# EAGLE design ChaiNEO_FrontConn_2x3 (EAGLE 9.6.2)
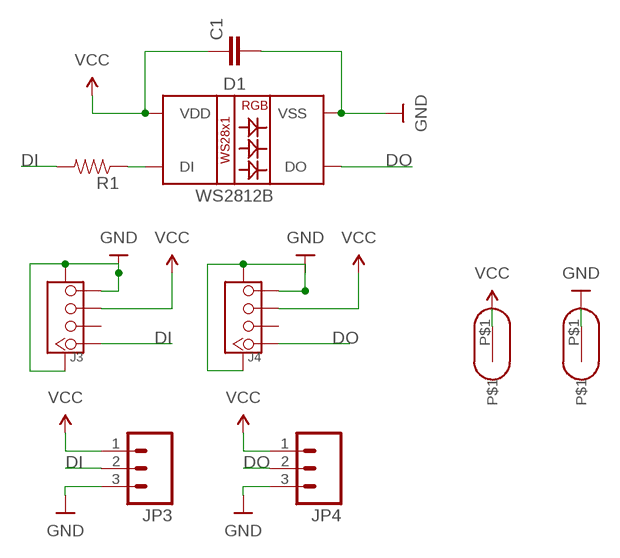
[diagram p0: schematic, sheet 1]

## Parts
C1  CAP0603-CAP  [0603-CAP]
D1  WS2812B  [WS2812B]
J3  TWIG-4P-2.0-SMD-FEMALE-REINFORCE90D  [4P-SMD-2.0-90D]
J4  TWIG-4P-2.0-SMD-FEMALE-REINFORCE90D  [4P-SMD-2.0-90D]
JP3  M03LONGPADS  [1X03_LONGPADS]
JP4  M03LONGPADS  [1X03_LONGPADS]
R1  RESISTOR0603-RES  [0603-RES]
U$7  PLATED_TIE_MOUNT  [PLATED_TIE_MOUNT]
U$8  PLATED_TIE_MOUNT  [PLATED_TIE_MOUNT]

## Nets
DI: J3.1 JP3.2 R1.2
DO: D1.2(DO) J4.1 JP4.2
GND: C1.2 D1.3(VSS) J3.4 J3.SS1 J3.SS2 J4.4 J4.SS1 J4.SS2 JP3.3 JP4.3 U$8.P$1
N$2: D1.4(DI) R1.1
VCC: C1.1 D1.1(VDD) J3.3 J4.3 JP3.1 JP4.1 U$7.P$1
Unconnected: J3.2 J4.2

## Library data of the parts
C1 = ChaiNEO:CAP: Capacitor Standard 0603 ceramic capacitor, and 0.1" leaded capacitor.
D1 = ChaiNEO:WS2812B: WS2812B SMD addressable RGB LED 5x5mm SMD LED with built-in controller IC. Color: Red/Green/Blue mC Rating: RGB: 390, 660, 180 mcd Forward Voltage: RGB: 2.0, 3.0, 3.0 V Packages:WS2812B SparkFun Products: Blynk Board - ESP8266 <https://www.sparkfun.com/products/13794>; PROD_ID: DIO-12503
J3 J4 = Grove_SMD:TWIG-4P-2.0-SMD-FEMALE-REINFORCE
JP3 JP4 = ChaiNEO:M03: Header 3 Standard 3-pin 0.1" header. Use with straight break away headers (SKU : PRT-00116), right angle break away headers (PRT-00553), swiss pins (PRT-00743), machine pins (PRT-00117), and female headers (PRT-00115). Molex polarized connector foot print use with SKU : PRT-08232 with associated crimp pins and housings.
R1 = ChaiNEO:RESISTOR: Resistor Basic schematic elements and footprints for 0603, 1206, and PTH resistors.
U$7 U$8 = ChaiNEO:PLATED_TIE_MOUNT

## Board
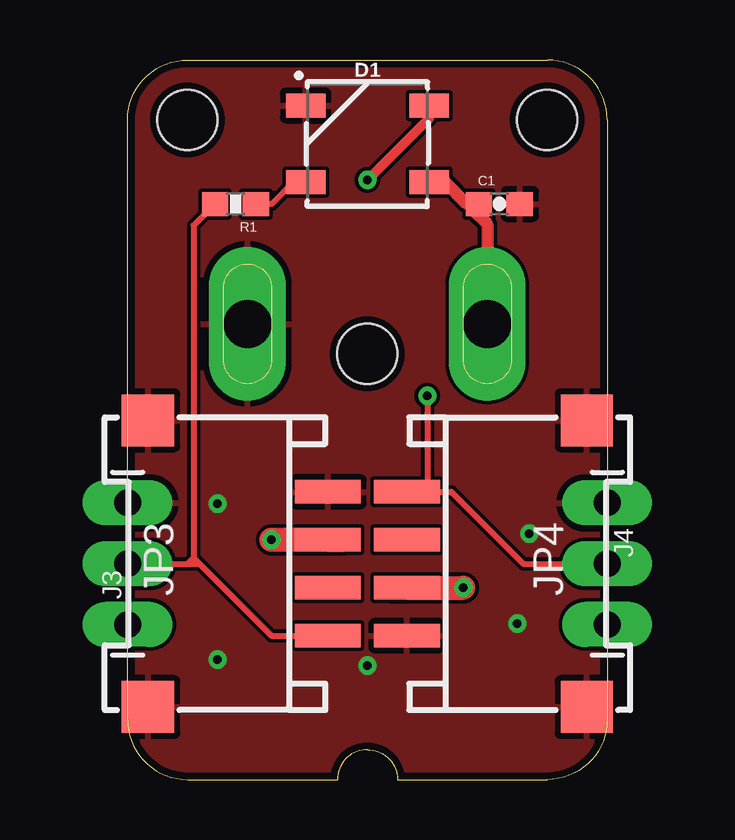
[diagram p1: board, top side]
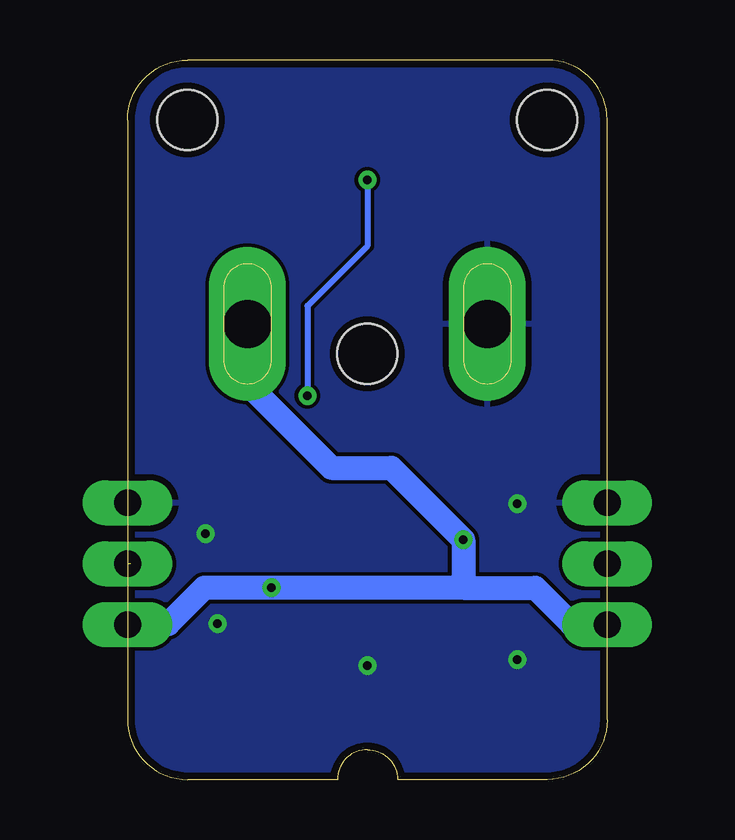
[diagram p2: board, bottom side, seen from below]

Size 20 x 30 mm. Coordinates in mm from the lower left corner, seen from the top.
Outline: 2.5,0 8.75,0 arc-90 10,1.25 arc-90 11.25,0 17.5,0 arc90 20,2.5 20,27.5 arc90 17.5,30 2.5,30 arc90 0,27.5 0,2.5 arc90 2.5,0
Copper layers (1*16): Top 0.035mm / dielectric 1.5mm / Bottom 0.035mm
Design rules "default *": minimum track width 6mil, minimum drill 0.35mm, track to track 6mil, track to pad 6mil, pad to pad 6mil, via to via 6mil, smd to smd 6mil, copper to edge 0.3mm, drill to drill 6mil, minimum pad ring 10mil, minimum via ring 8mil, stop-mask expansion 4mil, vias tented up to drill 20mil, thermal gap 10mil
Holes 2.5 mm at 10,17.75 2.5,27.5 17.5,27.5

### Footprints (pad centres in the part's own frame; a part is rotated, then mirrored left to right if it is on the bottom)
0603-CAP = smd 1.1 x 1: 1 -0.85,0; 2 0.85,0
WS2812B = smd 1.651 x 1: 1 2.577,-1.6; 2 2.577,1.6; 3 -2.577,1.6; 4 -2.577,-1.6
4P-SMD-2.0-90D = smd 0.965 x 2.74: 1 -3,-0.1; 2 -1,-0.1; 3 1,-0.1; 4 3,-0.1 | smd 2.159 x 2.184: SS1 -5.974,7.4; SS2 5.974,7.4
1X03_LONGPADS = drill 1.118 pad 1.88 long: 1 -2.54,0; 2 0,0; 3 2.54,0
0603-RES = smd 1.1 x 1: 1 -0.85,0; 2 0.85,0
PLATED_TIE_MOUNT = drill 2 pad 3.2 long: P$1 0,0

### Placement (x,y rotation side)
C1  15.5,24 0 top
D1  10,26.5 0 top
J3  8.25,9 90 top
J4  11.75,9 270 top
JP3  0,9 90 top
JP4  20,9 90 top
R1  4.5,24 180 top
U$7  15,19 0 top
U$8  5,19 0 top

### Tracks (layer width: path | path; a pad name or v marks a point on that pad's centre or on a via)
DI
  Top 0.254: J3.1 6,6 3,9 | JP3.2 2.5,9 | 2.5,9 2.75,9 | 2.75,9 3,9 | R1.2 2.75,23.1 2.75,9.25 | 2.75,9.25 2.75,9 | 2.75,9.25 2.5,9 | 2.75,9.25 3,9
DO  (via drill 0.35)  (1 unrouted)
  Top 0.254: v12.5,16 12.5,12.2 12.3,12 J4.1 13.5,12 16.5,9 19.87,9
  Top 0.406: v10,25 12.58,27.58 D1.2
  Bottom 0.254: v10,25 10,22.25 12.5,19.75 v12.5,16
GND  (via drill 0.35)
  other vias: 16.75,10.25 16.25,6.5 3.75,5 3.75,11.5 10,4.75
  pour Bottom: -0.5,-1 20.5,-1 20.5,31 -0.5,31
  pour Top: -1,-2 21,-2 21,32 -1,32
N$2
  Top 0.254: D1.4 6.92,24.9 6.02,24 R1.1
VCC  (via drill 0.35)
  Top 0.508: D1.1 13.25,24.9 14.15,24 C1.1 14.4,23.75 15,23.15 U$7.P$1
  Top 1: 9,10 J3.3 v6,10 | 11,8 J4.3 v14,8
  Bottom 1: 6,8 v14,8 16.8,8 18.3,6.5 | 6,8 3,8 1.5,6.5 | 6,8 v6,10 9,13 11.5,13 15,16.5
  Bottom 1.016: JP4.1 19.96,6.5 18.3,6.5 | JP3.1 0.04,6.5 1.5,6.5 | 15,16.5 U$7.P$1